# Altium project PCB_Project1.PrjPCB
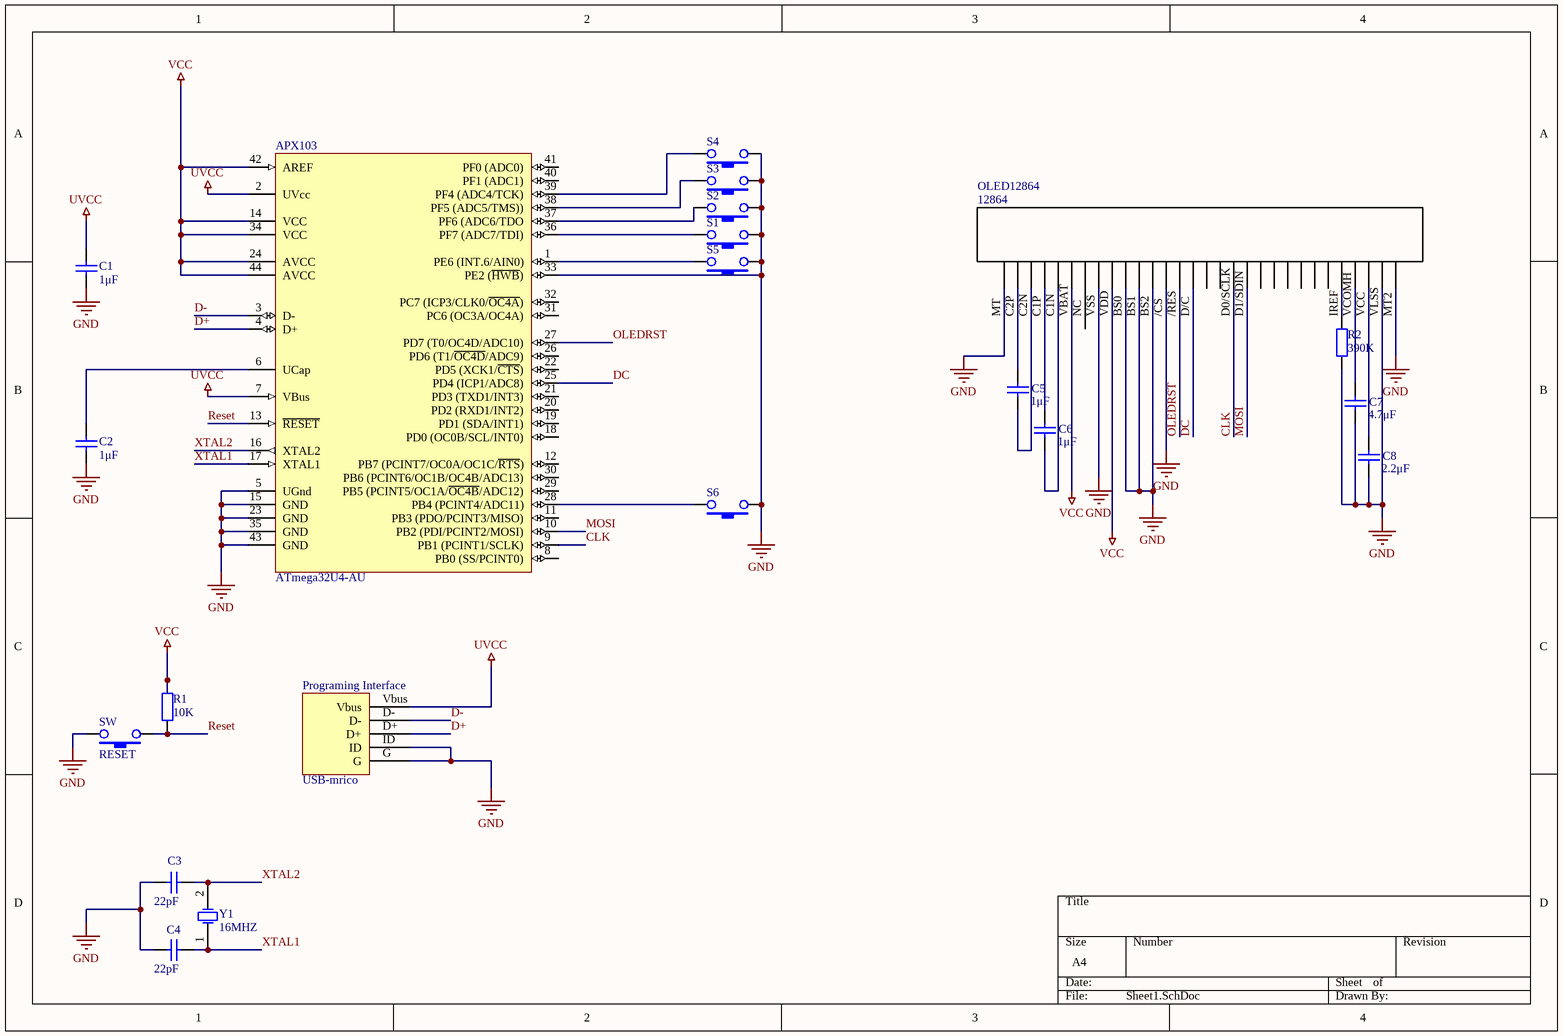
[diagram p0: Sheet1.SchDoc]
1 sheet, 21 parts. Net scope: global (net labels, ports and power ports of the same name join across sheets).
Board file: ARDUBOY.PcbDoc

## Sheet Sheet1.SchDoc
size A4

### Parts
APX103  ATmega32U4-AU  [44ML_N]
C1  1μF  [C0603]
C2  1μF  [C0603]
C3  22pF  [C0603]
C4  22pF  [C0603]
C5  1μF  [C0603]
C6  1μF  [C0603]
C7  4.7μF  [C0603]
C8  2.2μF  [C0603]
OLED12864  12864  [12864]
Programing_Interface  USB-mrico  [micro_USB]
R1  10K  [R0603]
R2  390K  [R0603]
S1  RESET  [KEY-SMT]  (value not drawn)
S2  move  [KEY-SMT]  (value not drawn)
S3  move  [KEY-SMT]  (value not drawn)
S4  move  [KEY-SMT]  (value not drawn)
S5  AB  [KEY-SMT]  (value not drawn)
S6  AB  [KEY-SMT]  (value not drawn)
SW  RESET  [KEY-SMT]
Y1  16MHZ  [XTAL1]

### Nets
GND: APX103.5(UGnd) APX103.15(GND) APX103.23(GND) APX103.33(PE2_(~{HWB})) APX103.35(GND) APX103.43(GND) C1.1 C2.1 C3.2 C4.2 C7.1 C8.1 OLED12864./CS OLED12864.BS0 OLED12864.BS1 OLED12864.BS2 OLED12864.MT OLED12864.MT2 OLED12864.VLSS OLED12864.VSS Programing_Interface.G Programing_Interface.ID R2.1 S1.1 S2.1 S3.1 S4.1 S5.1 S6.1 SW.2
UVCC: APX103.2(UVcc) APX103.7(VBus) C1.2 Programing_Interface.Vbus
VCC: APX103.14(VCC) APX103.24(AVCC) APX103.34(VCC) APX103.42(AREF) APX103.44(AVCC) OLED12864.VBAT OLED12864.VDD R1.2
CLK: APX103.9(PB1_(PCINT1/SCLK)) OLED12864.D0/SCLK
D+: APX103.4(D+) Programing_Interface.D+
D-: APX103.3(D-) Programing_Interface.D-
DC: APX103.25(PD4_(ICP1/ADC8)) OLED12864.D/C
MOSI: APX103.10(PB2_(PDI/PCINT2/MOSI)) OLED12864.D1/SDIN
OLEDRST: APX103.27(PD7_(T0/OC4D/ADC10)) OLED12864./RES
Reset: APX103.13(~{RESET}) R1.1 SW.1
XTAL1: APX103.17(XTAL1) C4.1 Y1.1(OSC1)
XTAL2: APX103.16(XTAL2) C3.1 Y1.2(OSC2)
NetAPX103_1: APX103.1(PE6_(INT.6/AIN0)) S5.2
NetAPX103_6: APX103.6(UCap) C2.2
NetAPX103_28: APX103.28(PB4_(PCINT4/ADC11)) S6.2
NetAPX103_36: APX103.36(PF7_(ADC7/TDI)) S1.2
NetAPX103_37: APX103.37(PF6_(ADC6/TDO) S2.2
NetAPX103_38: APX103.38(PF5_(ADC5/TMS))) S3.2
NetAPX103_39: APX103.39(PF4_(ADC4/TCK)) S4.2
NetC5_1: C5.1 OLED12864.C2N
NetC5_2: C5.2 OLED12864.C2P
NetC6_1: C6.1 OLED12864.C1N
NetC6_2: C6.2 OLED12864.C1P
NetC7_2: C7.2 OLED12864.VCOMH
NetC8_2: C8.2 OLED12864.VCC
NetOLED12864_IREF: OLED12864.IREF R2.2

Not connected (* = marked no-connect by the designer): APX103 8(PB0_(SS/PCINT0)) 11(PB3_(PDO/PCINT3/MISO)) 12(PB7_(PCINT7/OC0A/OC1C/~{RTS})) 18(PD0_(OC0B/SCL/INT0)) 19(PD1_(SDA/INT1)) 20(PD2_(RXD1/INT2)) 21(PD3_(TXD1/INT3)) 22(PD5_(XCK1/~{CTS})) 26(PD6_(T1/~{OC4D}/ADC9)) 29(PB5_(PCINT5/OC1A/~{OC4B}/ADC12)) 30(PB6_(PCINT6/OC1B/OC4B/ADC13)) 31(PC6_(OC3A/OC4A)) 32(PC7_(ICP3/CLK0/~{OC4A})) 40(PF1_(ADC1)) 41(PF0_(ADC0)); OLED12864 NC(7)

### Library data of the parts
APX103 = ATmega32U4-AU: 8-bit AVR Microcontroller, 2.7-5.5V, 32KB Flash, 2.5KB EEPROM, 1KB SRAM, USB Controller, 44-pin TQFP, Industrial Grade (-40癈 to 85癈); Published: 1-Apr-2010; DatasheetVersion: revD, Jan-2009; PackageVersion: rev.G, Jul-2007; PackageReference: 44ML; Publisher: Altium Limited; PackageDescription: 44-Pin Plastic Thin Quad Flat Pack, 10 x 10 x 1.0 mm Body, 0.8 mm Pitch (TQFP); Supplier 1: Digi-Key; Supplier Part Number 1: ATMEGA32U4-AU-ND; Supplier 2: Farnell; Supplier Part Number 2: 1748525; Supplier 3: Mouser; Supplier Part Number 3: 556-ATMEGA32U4-AU; ComponentLink1Description: Manufacturer Link; ComponentLink1URL: http://www.atmel.com/products/avr/default.asp?; ComponentLink2Description: ATmega16U4/32U4 Datasheet; ComponentLink2URL: http://www.atmel.com/dyn/resources/prod_documents/doc7766.pdf; ComponentLink3Description: ATmega16U4 ATmega32U4 Summary; ComponentLink3URL: http://www.atmel.com/dyn/resources/prod_documents/7766S.pdf; ComponentLink4Description: Atmel.com Home; ComponentLink4URL: http://www.atmel.com
C1-C8 = Cap: Capacitor; Value: 104; Published: 8-Jun-2000; LatestRevisionDate: 17-Jul-2002; LatestRevisionNote: Re-released for DXP Platform.; Publisher: Altium Limited
Programing_Interface = usb-STM
R1 R2 = Res2: Resistor; Published: 8-Jun-2000; LatestRevisionDate: 17-Jul-2002; LatestRevisionNote: Re-released for DXP Platform.; Publisher: Altium Limited
S1-S6 SW = SW-PB_V: SWITCH
Y1 = XTAL: Crystal Oscillator; Published: 8-Jun-2000; LatestRevisionDate: 17-Jul-2002; LatestRevisionNote: Re-released for DXP Platform.; Publisher: Altium Limited